# Altium schematic sheet 0091_USB3.SchDoc
size 848 x 558 mm
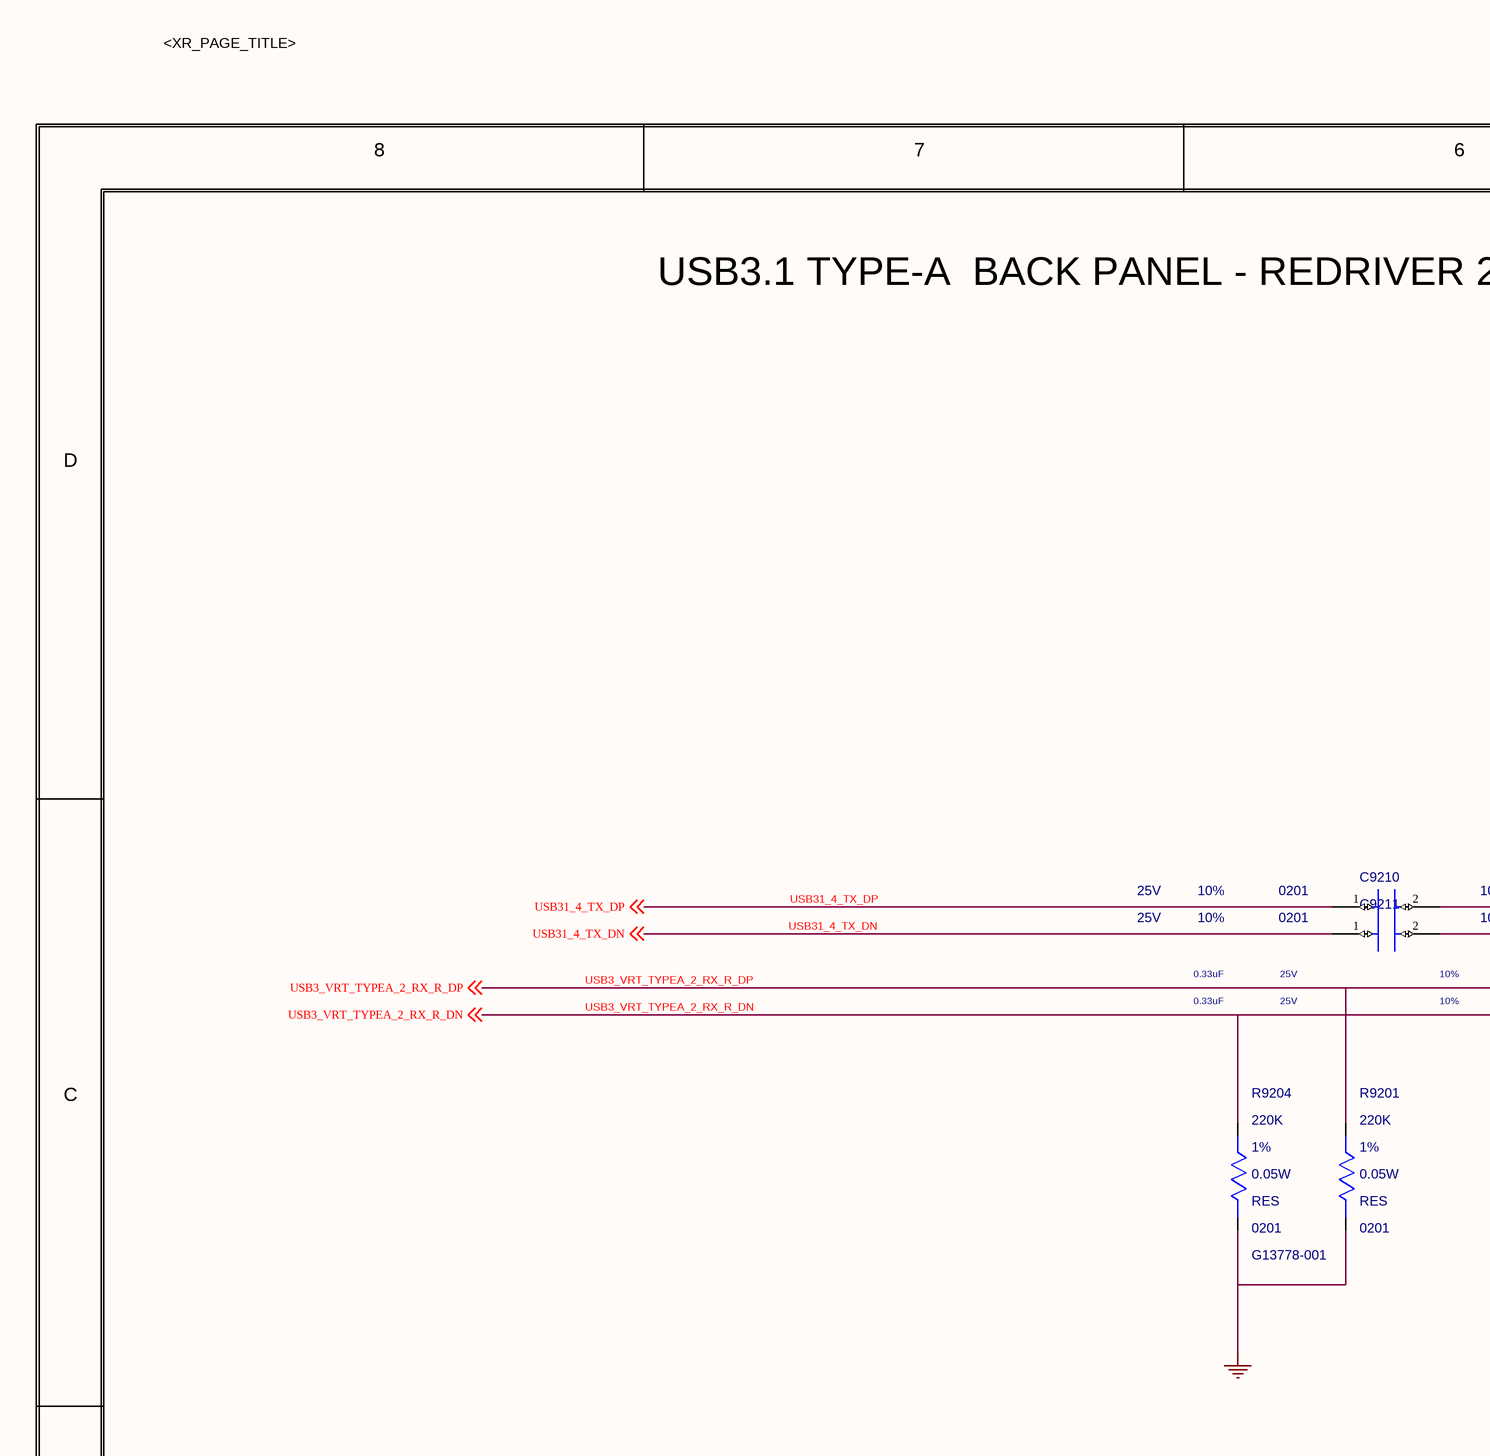
[diagram p0: 0091_USB3.SchDoc, top left]
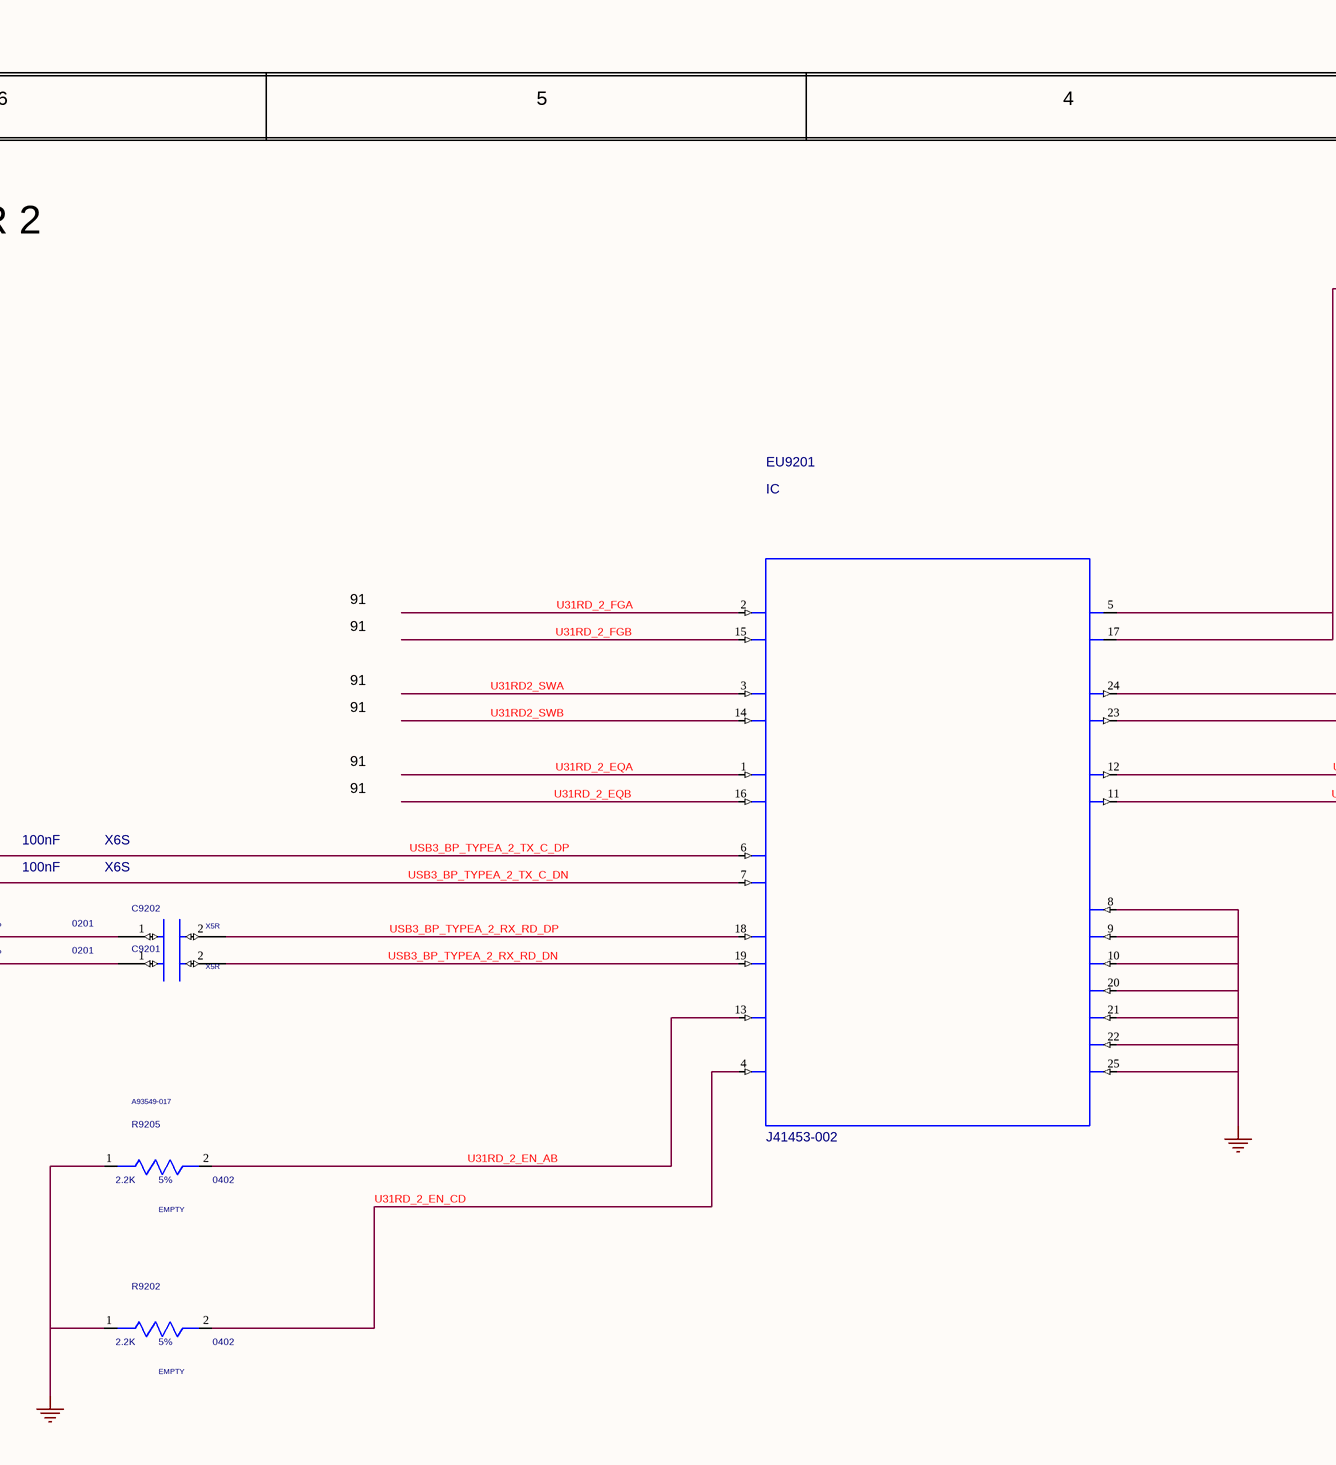
[diagram p1: 0091_USB3.SchDoc, top middle]
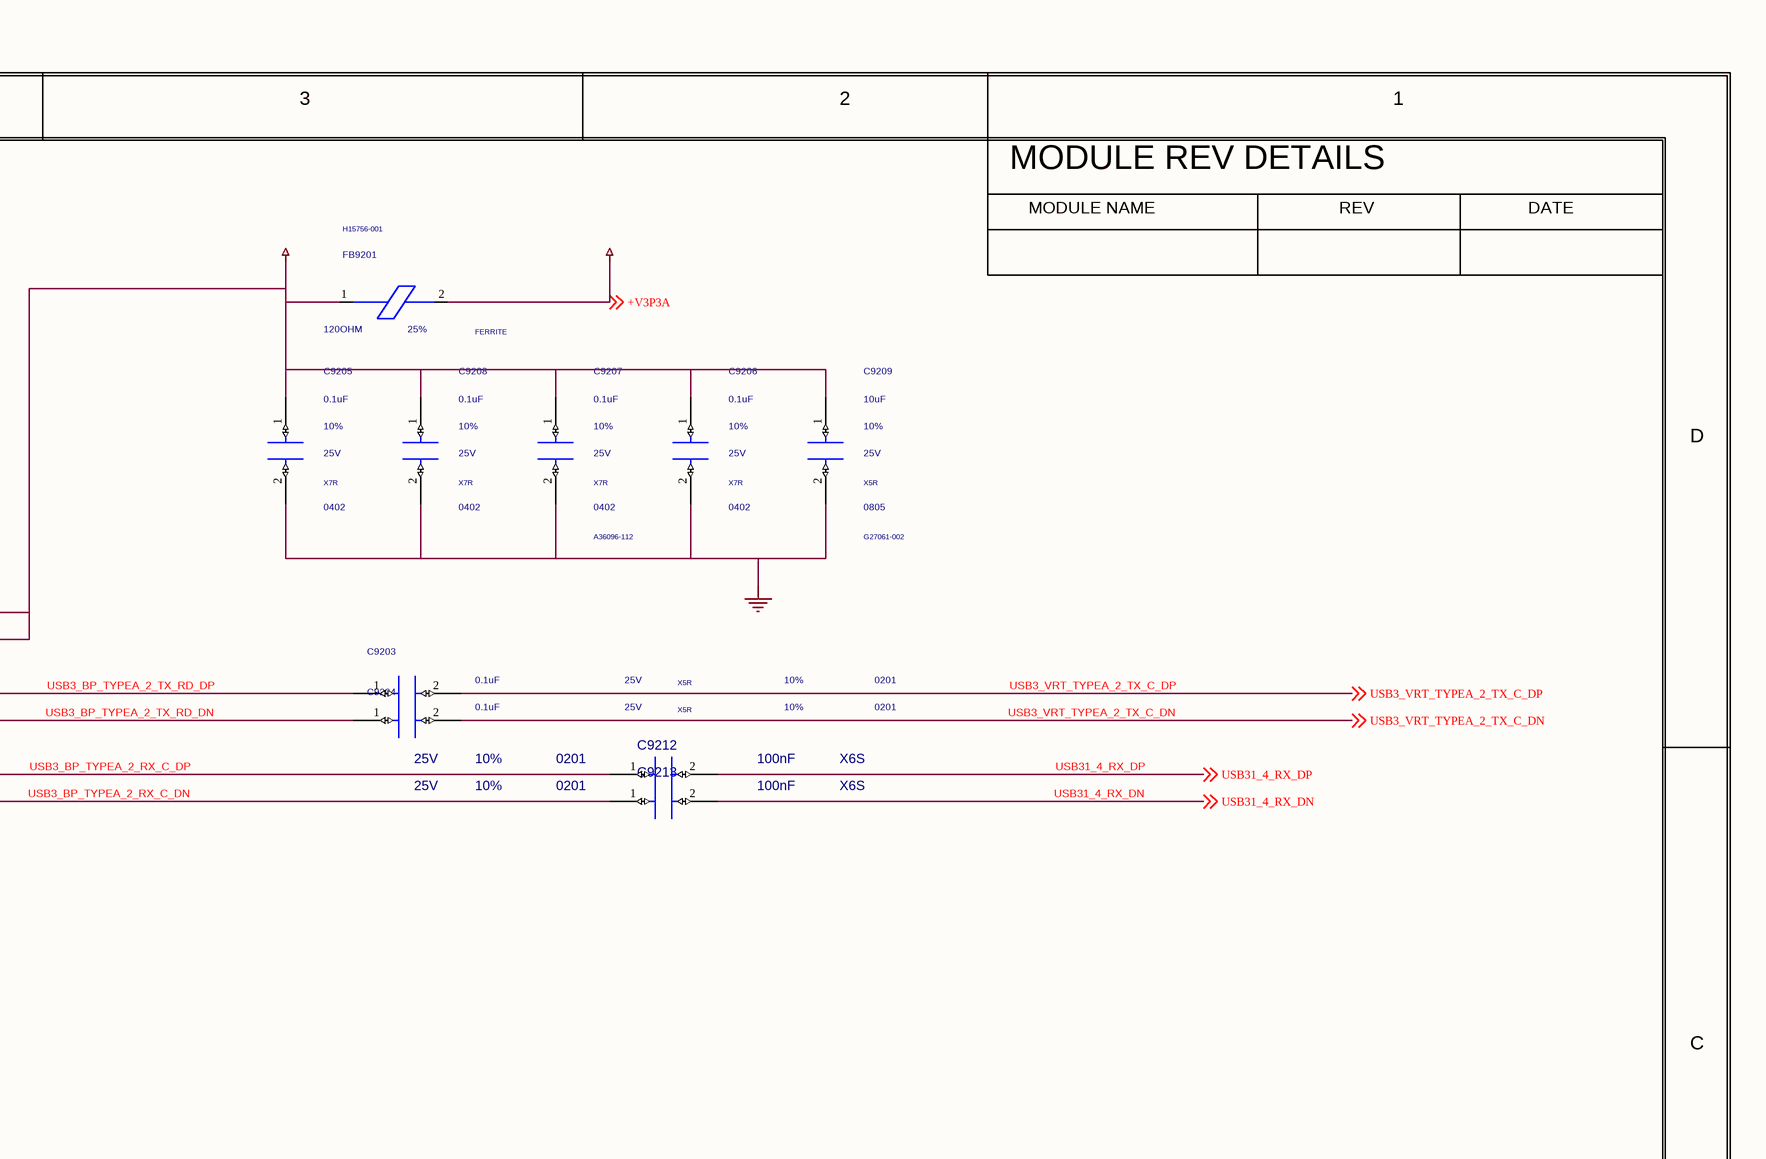
[diagram p2: 0091_USB3.SchDoc, top right]
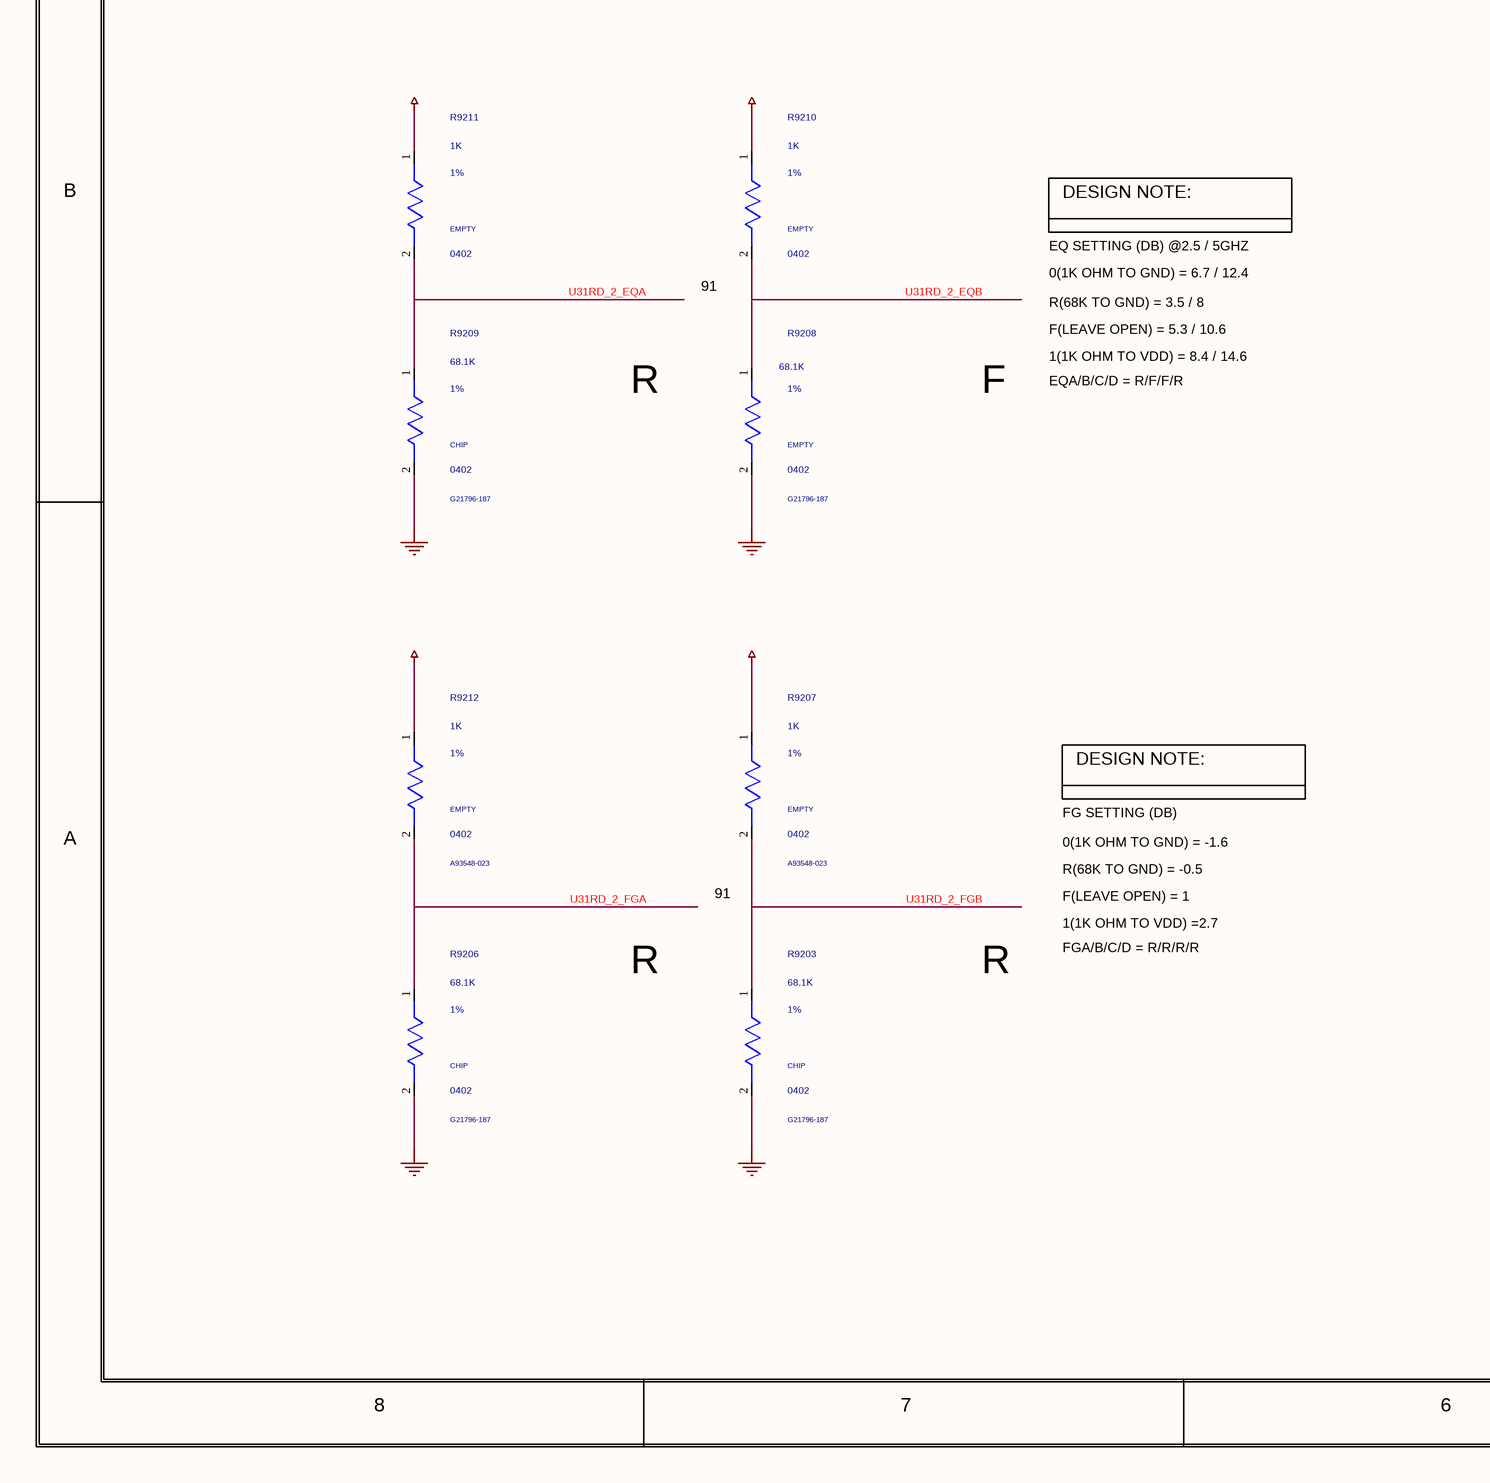
[diagram p3: 0091_USB3.SchDoc, bottom left]
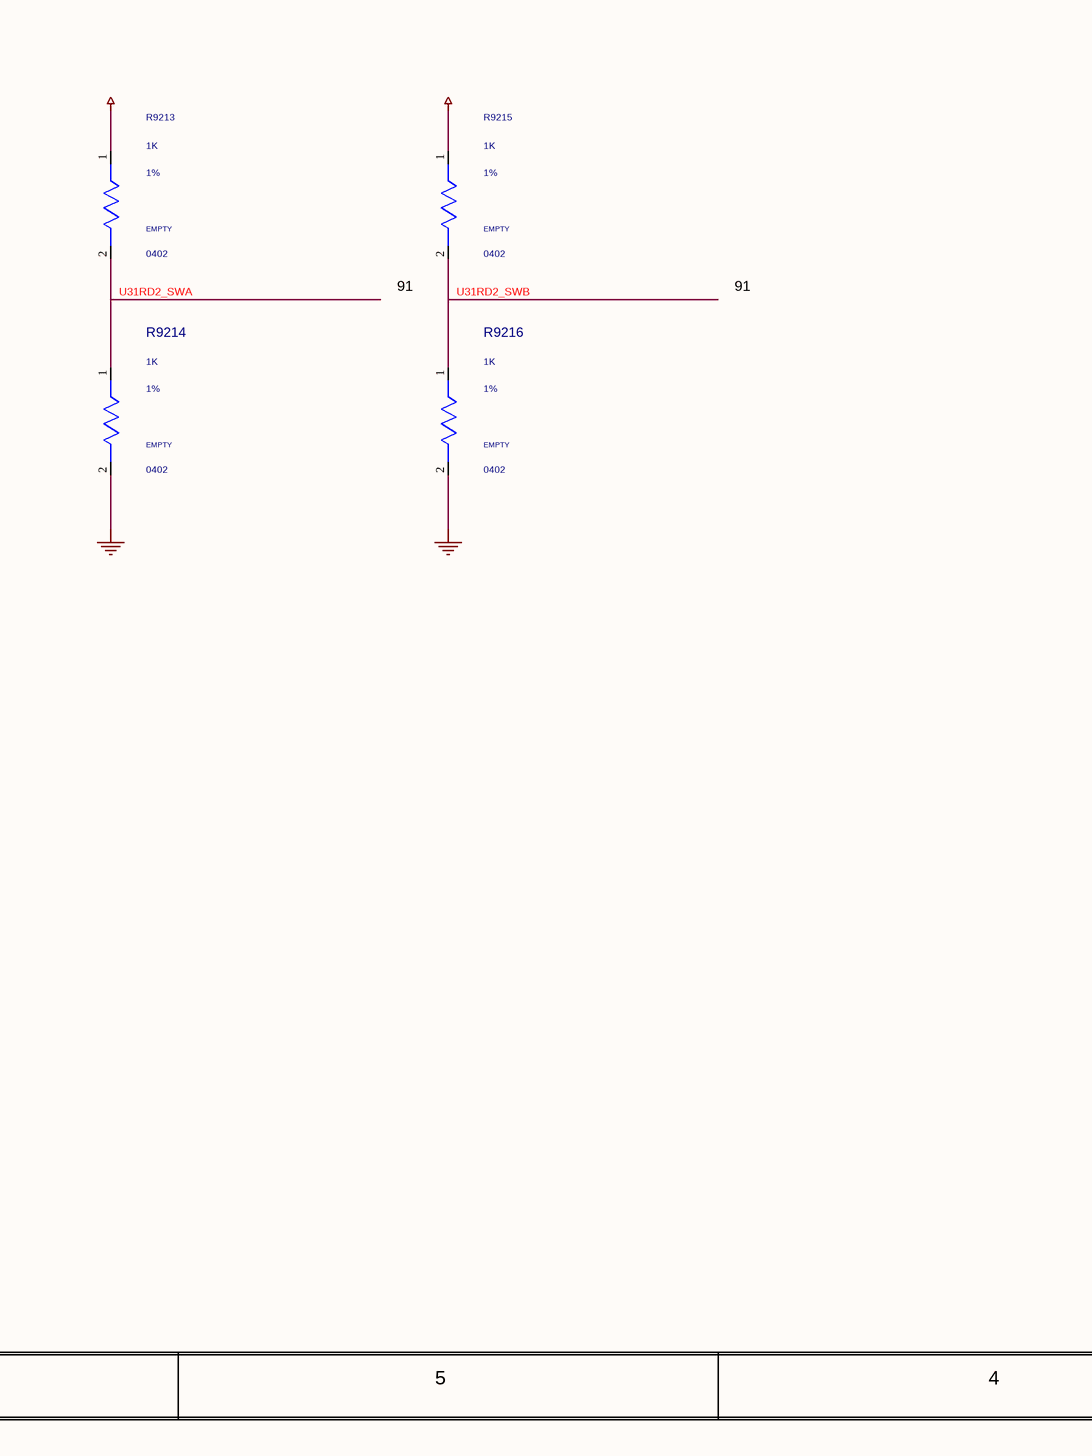
[diagram p4: 0091_USB3.SchDoc, bottom middle]
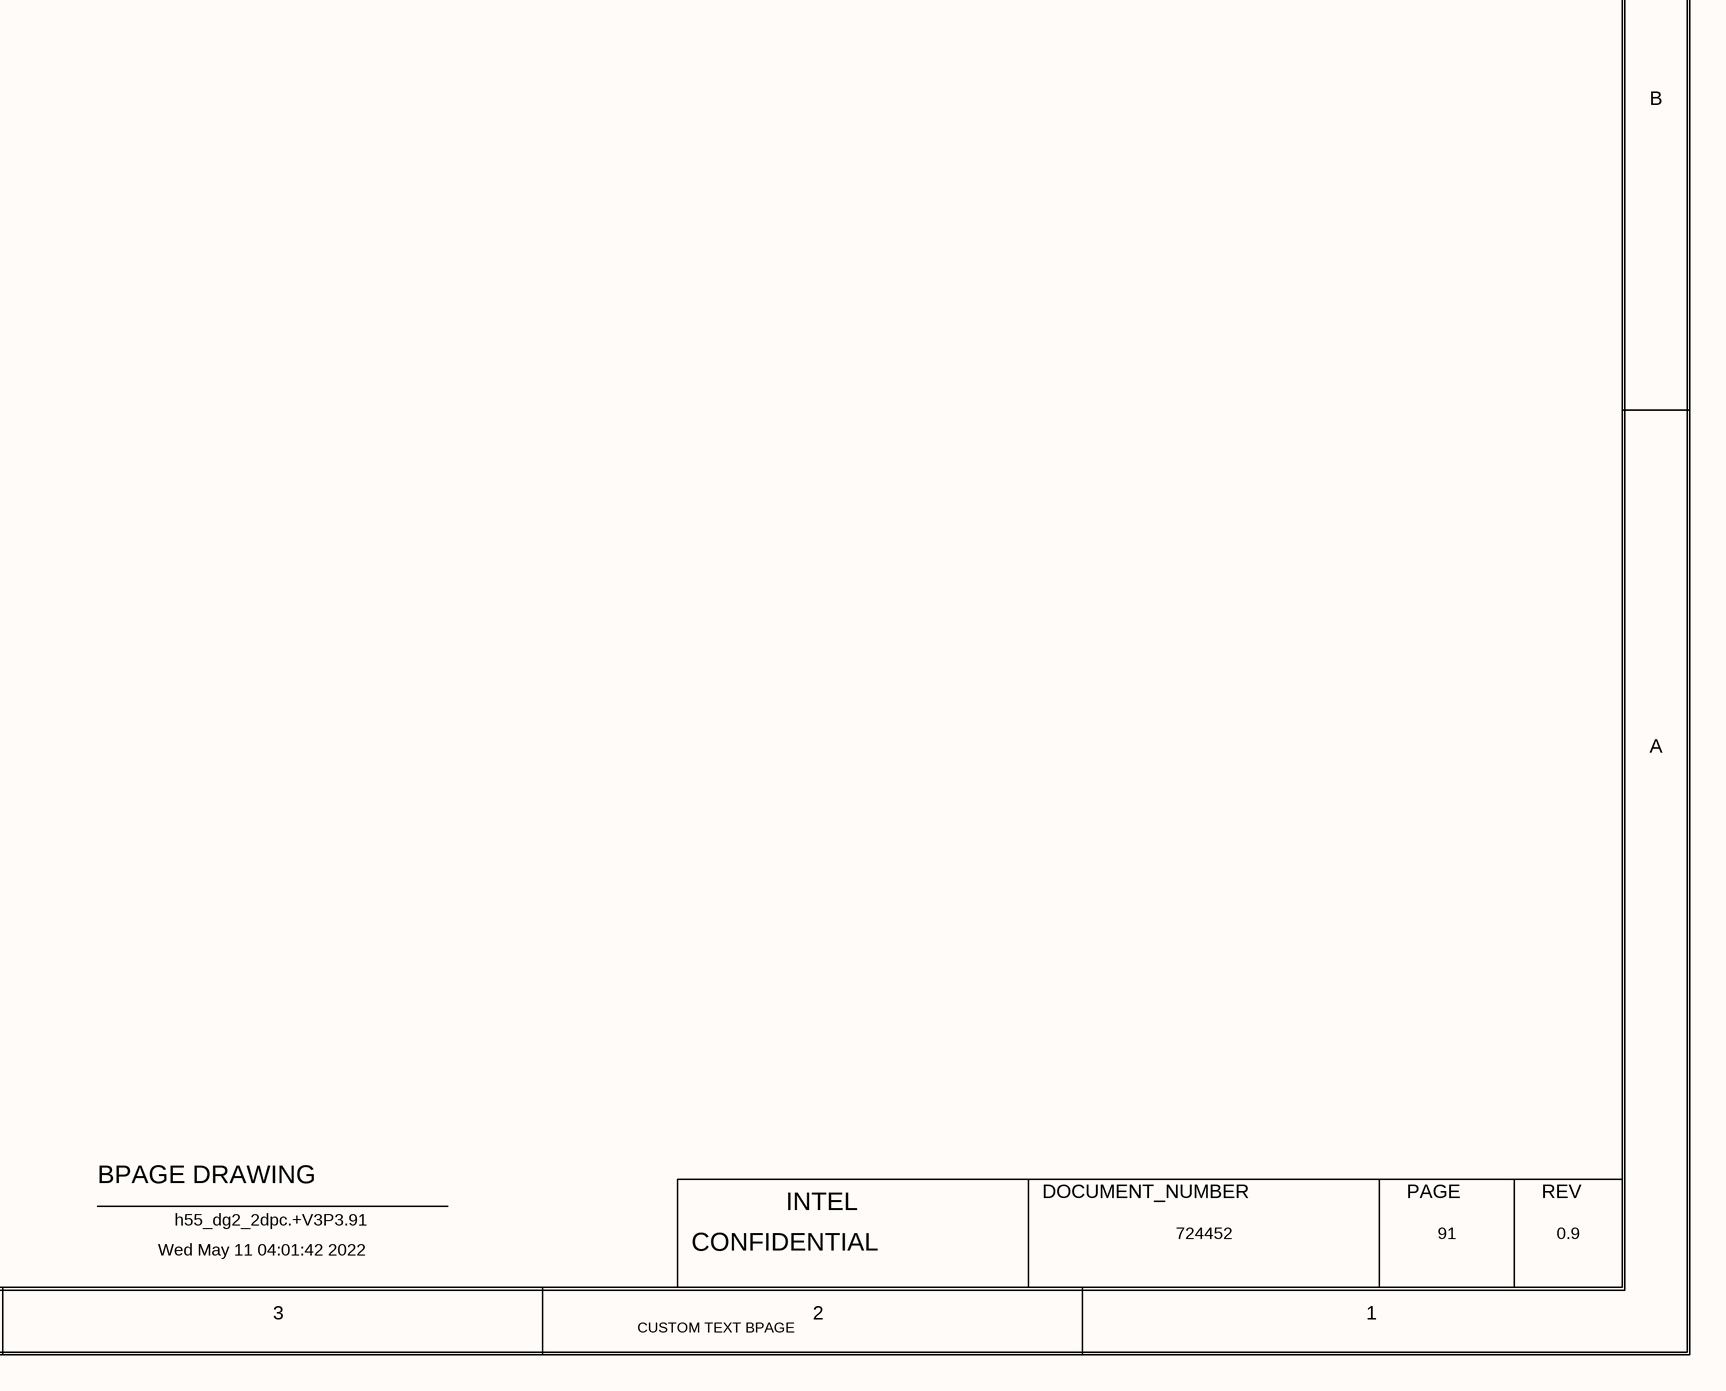
[diagram p5: 0091_USB3.SchDoc, bottom right]

## Parts
C9201  0.33uF  MATERIAL: X5R  PACK_TYPE: 0201  TOLERANCE: 10%  VOLTAGE: 25V  [SMC0201IA]
C9202  0.33uF  MATERIAL: X5R  PACK_TYPE: 0201  TOLERANCE: 10%  VOLTAGE: 25V  [SMC0201IA]
C9203  0.1uF  MATERIAL: X5R  PACK_TYPE: 0201  TOLERANCE: 10%  VOLTAGE: 25V  [SMC0201IA]
C9204  0.1uF  MATERIAL: X5R  PACK_TYPE: 0201  TOLERANCE: 10%  VOLTAGE: 25V  [SMC0201IA]
C9205  0.1uF  MATERIAL: X7R  PACK_TYPE: 0402  TOLERANCE: 10%  VOLTAGE: 25V  [SMC0402IA]
C9206  0.1uF  MATERIAL: X7R  PACK_TYPE: 0402  TOLERANCE: 10%  VOLTAGE: 25V  [SMC0402IA]
C9207  0.1uF  MATERIAL: X7R  PACK_TYPE: 0402  PART_NUMBER: A36096-112  TOLERANCE: 10%  VOLTAGE: 25V  [SMC0402IA]
C9208  0.1uF  MATERIAL: X7R  PACK_TYPE: 0402  TOLERANCE: 10%  VOLTAGE: 25V  [SMC0402IA]
C9209  10uF  MATERIAL: X5R  PACK_TYPE: 0805  PART_NUMBER: G27061-002  TOLERANCE: 10%  VOLTAGE: 25V  [SMC0805MA]
C9210  100nF  MATERIAL: X6S  PACK_TYPE: 0201  TOLERANCE: 10%  VOLTAGE: 25V  [SMC0201IA]
C9211  100nF  MATERIAL: X6S  PACK_TYPE: 0201  TOLERANCE: 10%  VOLTAGE: 25V  [SMC0201IA]
C9212  100nF  MATERIAL: X6S  PACK_TYPE: 0201  TOLERANCE: 10%  VOLTAGE: 25V  [SMC0201IA]
C9213  100nF  MATERIAL: X6S  PACK_TYPE: 0201  TOLERANCE: 10%  VOLTAGE: 25V  [SMC0201IA]
EU9201  MATERIAL: IC  PART_NUMBER: J41453-002  [CTK2_LCC24_S2550_350_DFS1400_MA]  (hidden comment: C_PI3EQX1002E)
FB9201  120OHM  PART_NUMBER: H15756-001  TOLERANCE: 25%  [SFB0603IB]
R9201  220K  MATERIAL: RES  PACK_TYPE: 0201  TOLERANCE: 1%  WATTAGE: 0.05W  [CTK2_SM0201_650X350_MA]
R9202  2.2K  MATERIAL: EMPTY  PACK_TYPE: 0402  TOLERANCE: 5%  [SMR0402IA]
R9203  68.1K  MATERIAL: CHIP  PACK_TYPE: 0402  PART_NUMBER: G21796-187  TOLERANCE: 1%  [SMR0402IA]
R9204  220K  MATERIAL: RES  PACK_TYPE: 0201  PART_NUMBER: G13778-001  TOLERANCE: 1%  WATTAGE: 0.05W  [CTK2_SM0201_650X350_MA]
R9205  2.2K  MATERIAL: EMPTY  PACK_TYPE: 0402  PART_NUMBER: A93549-017  TOLERANCE: 5%  [SMR0402IA]
R9206  68.1K  MATERIAL: CHIP  PACK_TYPE: 0402  PART_NUMBER: G21796-187  TOLERANCE: 1%  [SMR0402IA]
R9207  1K  MATERIAL: EMPTY  PACK_TYPE: 0402  PART_NUMBER: A93548-023  TOLERANCE: 1%  [SMR0402IA]
R9208  68.1K  MATERIAL: EMPTY  PACK_TYPE: 0402  PART_NUMBER: G21796-187  TOLERANCE: 1%  [SMR0402IA]
R9209  68.1K  MATERIAL: CHIP  PACK_TYPE: 0402  PART_NUMBER: G21796-187  TOLERANCE: 1%  [SMR0402IA]
R9210  1K  MATERIAL: EMPTY  PACK_TYPE: 0402  TOLERANCE: 1%  [SMR0402IA]
R9211  1K  MATERIAL: EMPTY  PACK_TYPE: 0402  TOLERANCE: 1%  [SMR0402IA]
R9212  1K  MATERIAL: EMPTY  PACK_TYPE: 0402  PART_NUMBER: A93548-023  TOLERANCE: 1%  [SMR0402IA]
R9213  1K  MATERIAL: EMPTY  PACK_TYPE: 0402  TOLERANCE: 1%  [SMR0402IA]
R9214  1K  MATERIAL: EMPTY  PACK_TYPE: 0402  TOLERANCE: 1%  [SMR0402IA]
R9215  1K  MATERIAL: EMPTY  PACK_TYPE: 0402  TOLERANCE: 1%  [SMR0402IA]
R9216  1K  MATERIAL: EMPTY  PACK_TYPE: 0402  TOLERANCE: 1%  [SMR0402IA]

## Nets
+V3P3_DUAL_USBRD_2: C9205.1(A) C9206.1(A) C9207.1(A) C9208.1(A) C9209.1(A) EU9201.5(VDD_1) EU9201.17(VDD_2) FB9201.1(A) R9207.1(A) R9210.1(A) R9211.1(A) R9212.1(A) R9213.1(A) R9215.1(A)
+V3P3A: FB9201.2(B) ; off-sheet +V3P3A
GND: C9205.2(B) C9206.2(B) C9207.2(B) C9208.2(B) C9209.2(B) EU9201.8(GND_1) EU9201.9(GND_2) EU9201.10(GND_3) EU9201.20(GND_4) EU9201.21(GND_5) EU9201.22(GND_6) EU9201.25(GND_TPD) R9201.2(B) R9202.1(A) R9203.2(B) R9204.2(B) R9205.1(A) R9206.2(B) R9208.2(B) R9209.2(B) R9214.2(B) R9216.2(B)
U31RD2_SWA: EU9201.3(SWA) R9213.2(B) R9214.1(A)
U31RD2_SWB: EU9201.14(SWB) R9215.2(B) R9216.1(A)
U31RD_2_EN_AB: EU9201.13(RXDET_EN) R9205.2(B)
U31RD_2_EN_CD: EU9201.4(EN) R9202.2(B)
U31RD_2_EQA: EU9201.1(EQA) R9209.1(A) R9211.2(B)
U31RD_2_EQB: EU9201.16(EQB) R9208.1(A) R9210.2(B)
U31RD_2_FGA: EU9201.2(FGA) R9206.1(A) R9212.2(B)
U31RD_2_FGB: EU9201.15(FGB) R9203.1(A) R9207.2(B)
USB3_BP_TYPEA_2_RX_C_DN: C9213.1(A) EU9201.11(BON)
USB3_BP_TYPEA_2_RX_C_DP: C9212.1(A) EU9201.12(BOP)
USB3_BP_TYPEA_2_RX_RD_DN: C9201.2(B) EU9201.19(BIN)
USB3_BP_TYPEA_2_RX_RD_DP: C9202.2(B) EU9201.18(BIP)
USB3_BP_TYPEA_2_TX_C_DN: C9211.2(B) EU9201.7(AIN)
USB3_BP_TYPEA_2_TX_C_DP: C9210.2(B) EU9201.6(AIP)
USB3_BP_TYPEA_2_TX_RD_DN: C9204.1(A) EU9201.23(AON)
USB3_BP_TYPEA_2_TX_RD_DP: C9203.1(A) EU9201.24(AOP)
USB3_VRT_TYPEA_2_RX_R_DN: C9201.1(A) R9204.1(A) ; off-sheet USB3_VRT_TYPEA_2_RX_R_DN
USB3_VRT_TYPEA_2_RX_R_DP: C9202.1(A) R9201.1(A) ; off-sheet USB3_VRT_TYPEA_2_RX_R_DP
USB3_VRT_TYPEA_2_TX_C_DN: C9204.2(B) ; off-sheet USB3_VRT_TYPEA_2_TX_C_DN
USB3_VRT_TYPEA_2_TX_C_DP: C9203.2(B) ; off-sheet USB3_VRT_TYPEA_2_TX_C_DP
USB31_4_RX_DN: C9213.2(B) ; off-sheet USB31_4_RX_DN
USB31_4_RX_DP: C9212.2(B) ; off-sheet USB31_4_RX_DP
USB31_4_TX_DN: C9211.1(A) ; off-sheet USB31_4_TX_DN
USB31_4_TX_DP: C9210.1(A) ; off-sheet USB31_4_TX_DP

## Notes on the sheet
- <XR_PAGE_TITLE>
- 8
- 7
- 6
- 5
- 4
- 3
- 2
- 1
- MODULE REV DETAILS
- USB3.1 TYPE-A  BACK PANEL - REDRIVER 2
- MODULE NAME
- REV
- DATE
- D
- 91
- C
- B
- DESIGN NOTE:
- (near R9210) 91
- 0(1K OHM TO GND) = 6.7 / 12.4
- EQ SETTING (DB) @2.5 / 5GHZ
- R(68K TO GND) = 3.5 / 8
- F(LEAVE OPEN) = 5.3 / 10.6
- 1(1K OHM TO VDD) = 8.4 / 14.6
- (near R9215) 91
- R
- F
- EQA/B/C/D = R/F/F/R
- FG SETTING (DB)
- A
- 0(1K OHM TO GND) = -1.6
- R(68K TO GND) = -0.5
- F(LEAVE OPEN) = 1
- 1(1K OHM TO VDD) =2.7
- FGA/B/C/D = R/R/R/R
- BPAGE DRAWING
- INTEL
- DOCUMENT_NUMBER
- PAGE
- Wed May 11 04:01:42 2022
- h55_dg2_2dpc.+V3P3.91
- CONFIDENTIAL
- 724452
- 0.9
- CUSTOM TEXT BPAGE

## Library data of the parts
C9201 = CAP#1: PART_NUMBER: J96611-001; CHIPS_PART_NAME: CAP; CDS_PHYS_PART_NAME: CAP_0201-J96611-001,X5R,0.33UF,25V,10%,LPDB,GENERIC; OriginalSymbolOrigin: (-25,50); XY: (-5600,3500); VER: 2; ROT: 0; PHYS_PAGE: 91; LOCATION: C9201; IP: GENERIC; FP_TECH: LPDB; DRAWING: @RVP1_ADL_SB_ADP_S_DDR5_SODIMM_2DPC_LIB.H55_DG2_2DPC(SCH_1):PAGE462; CDS_LIB: discrete; PCB Footprint: SMC0201IA; SEC_TYPE: 0201; CDS_PART_NAME: CAP_0201-J96611-001,X5R,0.33UF,25V,10%,LPDB,GENERIC; CDS_LOCATION: C9201; ASI_MODEL: J96611-001
C9202 = CAP#1: PART_NUMBER: J96611-001; CHIPS_PART_NAME: CAP; CDS_PHYS_PART_NAME: CAP_0201-J96611-001,X5R,0.33UF,25V,10%,LPDB,GENERIC; OriginalSymbolOrigin: (-25,50); XY: (-5600,3550); VER: 2; ROT: 0; PHYS_PAGE: 91; LOCATION: C9202; IP: GENERIC; FP_TECH: LPDB; DRAWING: @RVP1_ADL_SB_ADP_S_DDR5_SODIMM_2DPC_LIB.H55_DG2_2DPC(SCH_1):PAGE462; CDS_LIB: discrete; PCB Footprint: SMC0201IA; SEC_TYPE: 0201; CDS_PART_NAME: CAP_0201-J96611-001,X5R,0.33UF,25V,10%,LPDB,GENERIC; CDS_LOCATION: C9202; ASI_MODEL: J96611-001
C9203 = CAP#1: PART_NUMBER: C83410-027; CHIPS_PART_NAME: CAP; CDS_PHYS_PART_NAME: CAP_0201-C83410-027,X5R,0.1UF,25V,10%,LPDB,GENERIC; OriginalSymbolOrigin: (-25,50); XY: (-2750,4000); VER: 2; ROT: 0; PHYS_PAGE: 91; LOCATION: C9203; IP: GENERIC; FP_TECH: LPDB; DRAWING: @RVP1_ADL_SB_ADP_S_DDR5_SODIMM_2DPC_LIB.H55_DG2_2DPC(SCH_1):PAGE462; CDS_LIB: discrete; PCB Footprint: SMC0201IA; SEC_TYPE: 0201; CDS_PART_NAME: CAP_0201-C83410-027,X5R,0.1UF,25V,10%,LPDB,GENERIC; CDS_LOCATION: C9203; ASI_MODEL: C83410-027
C9204 = CAP#1: PART_NUMBER: C83410-027; CHIPS_PART_NAME: CAP; CDS_PHYS_PART_NAME: CAP_0201-C83410-027,X5R,0.1UF,25V,10%,LPDB,GENERIC; OriginalSymbolOrigin: (-25,50); XY: (-2750,3950); VER: 2; ROT: 0; PHYS_PAGE: 91; LOCATION: C9204; IP: GENERIC; FP_TECH: LPDB; DRAWING: @RVP1_ADL_SB_ADP_S_DDR5_SODIMM_2DPC_LIB.H55_DG2_2DPC(SCH_1):PAGE462; CDS_LIB: discrete; PCB Footprint: SMC0201IA; SEC_TYPE: 0201; CDS_PART_NAME: CAP_0201-C83410-027,X5R,0.1UF,25V,10%,LPDB,GENERIC; CDS_LOCATION: C9204; ASI_MODEL: C83410-027
C9205 = CAP: PART_NUMBER: A36096-112; CDS_PHYS_PART_NAME: CAP_0402-A36096-112,X7R,0.1UF,25V,10%,LPDB,GENERIC; OriginalSymbolOrigin: (-50,25); XY: (-2975,4450); VER: 1; ROT: 0; PHYS_PAGE: 91; LOCATION: C9205; IP: GENERIC; FP_TECH: LPDB; DRAWING: @RVP1_ADL_SB_ADP_S_DDR5_SODIMM_2DPC_LIB.H55_DG2_2DPC(SCH_1):PAGE462; CDS_LIB: discrete; PCB Footprint: SMC0402IA; CHIPS_PART_NAME: CAP; CDS_PART_NAME: CAP_0402-A36096-112,X7R,0.1UF,25V,10%,LPDB,GENERIC; CDS_LOCATION: C9205; ASI_MODEL: A36096-112
C9206 = CAP: PART_NUMBER: A36096-112; CDS_PHYS_PART_NAME: CAP_0402-A36096-112,X7R,0.1UF,25V,10%,LPDB,GENERIC; OriginalSymbolOrigin: (-50,25); XY: (-2225,4450); VER: 1; ROT: 0; PHYS_PAGE: 91; LOCATION: C9206; IP: GENERIC; FP_TECH: LPDB; DRAWING: @RVP1_ADL_SB_ADP_S_DDR5_SODIMM_2DPC_LIB.H55_DG2_2DPC(SCH_1):PAGE462; CDS_LIB: discrete; PCB Footprint: SMC0402IA; CHIPS_PART_NAME: CAP; CDS_PART_NAME: CAP_0402-A36096-112,X7R,0.1UF,25V,10%,LPDB,GENERIC; CDS_LOCATION: C9206; ASI_MODEL: A36096-112
C9207 = CAP: CDS_PHYS_PART_NAME: CAP_0402-A36096-112,X7R,0.1UF,25V,10%,LPDB,GENERIC; OriginalSymbolOrigin: (-50,25); XY: (-2475,4450); VER: 1; ROT: 0; PHYS_PAGE: 91; LOCATION: C9207; IP: GENERIC; FP_TECH: LPDB; DRAWING: @RVP1_ADL_SB_ADP_S_DDR5_SODIMM_2DPC_LIB.H55_DG2_2DPC(SCH_1):PAGE462; CDS_LIB: discrete; PCB Footprint: SMC0402IA; CHIPS_PART_NAME: CAP; CDS_PART_NAME: CAP_0402-A36096-112,X7R,0.1UF,25V,10%,LPDB,GENERIC; CDS_LOCATION: C9207; ASI_MODEL: A36096-112
C9208 = CAP: PART_NUMBER: A36096-112; CDS_PHYS_PART_NAME: CAP_0402-A36096-112,X7R,0.1UF,25V,10%,LPDB,GENERIC; OriginalSymbolOrigin: (-50,25); XY: (-2725,4450); VER: 1; ROT: 0; PHYS_PAGE: 91; LOCATION: C9208; IP: GENERIC; FP_TECH: LPDB; DRAWING: @RVP1_ADL_SB_ADP_S_DDR5_SODIMM_2DPC_LIB.H55_DG2_2DPC(SCH_1):PAGE462; CDS_LIB: discrete; PCB Footprint: SMC0402IA; CHIPS_PART_NAME: CAP; CDS_PART_NAME: CAP_0402-A36096-112,X7R,0.1UF,25V,10%,LPDB,GENERIC; CDS_LOCATION: C9208; ASI_MODEL: A36096-112
C9209 = CAP: CDS_PHYS_PART_NAME: CAP_0805-G27061-002,X5R,10UF,25V,10%,LPDB,GENERIC; OriginalSymbolOrigin: (-50,25); XY: (-1975,4450); VER: 1; ROT: 0; PHYS_PAGE: 91; LOCATION: C9209; IP: GENERIC; FP_TECH: LPDB; DRAWING: @RVP1_ADL_SB_ADP_S_DDR5_SODIMM_2DPC_LIB.H55_DG2_2DPC(SCH_1):PAGE462; CDS_LIB: discrete; PCB Footprint: SMC0805MA; CHIPS_PART_NAME: CAP; CDS_PART_NAME: CAP_0805-G27061-002,X5R,10UF,25V,10%,LPDB,GENERIC; CDS_LOCATION: C9209; ASI_MODEL: G27061-002
C9210 = CAP#1: PART_NUMBER: H68299-001; CHIPS_PART_NAME: CAP; CDS_PHYS_PART_NAME: CAP_0201-H68299-001,X6S,100NF,25V,10%,LPDB,GENERIC; OriginalSymbolOrigin: (-25,50); XY: (-6050,3700); VER: 2; ROT: 0; PHYS_PAGE: 91; LOCATION: C9210; IP: GENERIC; FP_TECH: LPDB; DRAWING: @RVP1_ADL_SB_ADP_S_DDR5_SODIMM_2DPC_LIB.H55_DG2_2DPC(SCH_1):PAGE462; CDS_LIB: discrete; PCB Footprint: SMC0201IA; CDS_PART_NAME: CAP_0201-H68299-001,X6S,100NF,25V,10%,LPDB,GENERIC; CDS_LOCATION: C9210
C9211 = CAP#1: PART_NUMBER: H68299-001; CHIPS_PART_NAME: CAP; CDS_PHYS_PART_NAME: CAP_0201-H68299-001,X6S,100NF,25V,10%,LPDB,GENERIC; OriginalSymbolOrigin: (-25,50); XY: (-6050,3650); VER: 2; ROT: 0; PHYS_PAGE: 91; LOCATION: C9211; IP: GENERIC; FP_TECH: LPDB; DRAWING: @RVP1_ADL_SB_ADP_S_DDR5_SODIMM_2DPC_LIB.H55_DG2_2DPC(SCH_1):PAGE462; CDS_LIB: discrete; PCB Footprint: SMC0201IA; CDS_PART_NAME: CAP_0201-H68299-001,X6S,100NF,25V,10%,LPDB,GENERIC; CDS_LOCATION: C9211
C9212 = CAP#1: PART_NUMBER: H68299-001; CHIPS_PART_NAME: CAP; CDS_PHYS_PART_NAME: CAP_0201-H68299-001,X6S,100NF,25V,10%,LPDB,GENERIC; OriginalSymbolOrigin: (-25,50); XY: (-2275,3850); VER: 2; ROT: 0; PHYS_PAGE: 91; LOCATION: C9212; IP: GENERIC; FP_TECH: LPDB; DRAWING: @RVP1_ADL_SB_ADP_S_DDR5_SODIMM_2DPC_LIB.H55_DG2_2DPC(SCH_1):PAGE462; CDS_LIB: discrete; PCB Footprint: SMC0201IA; CDS_PART_NAME: CAP_0201-H68299-001,X6S,100NF,25V,10%,LPDB,GENERIC; CDS_LOCATION: C9212
C9213 = CAP#1: PART_NUMBER: H68299-001; CHIPS_PART_NAME: CAP; CDS_PHYS_PART_NAME: CAP_0201-H68299-001,X6S,100NF,25V,10%,LPDB,GENERIC; OriginalSymbolOrigin: (-25,50); XY: (-2275,3800); VER: 2; ROT: 0; PHYS_PAGE: 91; LOCATION: C9213; IP: GENERIC; FP_TECH: LPDB; DRAWING: @RVP1_ADL_SB_ADP_S_DDR5_SODIMM_2DPC_LIB.H55_DG2_2DPC(SCH_1):PAGE462; CDS_LIB: discrete; PCB Footprint: SMC0201IA; CDS_PART_NAME: CAP_0201-H68299-001,X6S,100NF,25V,10%,LPDB,GENERIC; CDS_LOCATION: C9213
EU9201 = C_PI3EQX1002E: CDS_PHYS_PART_NAME: C_PI3EQX1002E_LCC-J41453-002,IC,PI3EQX1002E2ZREX,TK2,GENERIC; CDS_LMAN_SYM_OUTLINE: -300,550,300,-500; FP_TECH: TK2; IP: GENERIC; PACK_TYPE: LCC; ROOM: NONE; OriginalSymbolOrigin: (-325,550); XY: (-4200,3700); VER: 1; ROT: 0; PHYS_PAGE: 91; LOCATION: EU9201; DRAWING: @RVP1_ADL_SB_ADP_S_DDR5_SODIMM_2DPC_LIB.H55_DG2_2DPC(SCH_1):PAGE462; CDS_LIB: local; VARIANT: ?; PCB Footprint: CTK2_LCC24_S2550_350_DFS1400_MA; SEC_TYPE: LCC; CHIPS_PART_NAME: C_PI3EQX1002E; CDS_PART_NAME: C_PI3EQX1002E_LCC-J41453-002,IC,PI3EQX1002E2ZREX,TK2,GENERIC; CDS_LOCATION: EU9201
FB9201 = FERRITE: CDS_PHYS_PART_NAME: FERRITE_0603-H15756-001,FERRITE,120OHM,25%,3A,LPDB,GENERIC; CURRENT: 3A; PACK_TYPE: 0603; OriginalSymbolOrigin: (-75,50); XY: (-2775,4725); VER: 1; ROT: 0; PHYS_PAGE: 91; LOCATION: FB9201; IP: GENERIC; FP_TECH: LPDB; DRAWING: @RVP1_ADL_SB_ADP_S_DDR5_SODIMM_2DPC_LIB.H55_DG2_2DPC(SCH_1):PAGE462; CDS_LIB: discrete; MATERIAL: FERRITE; PCB Footprint: SFB0603IB; SEC_TYPE: 0603; CHIPS_PART_NAME: FERRITE; CDS_PART_NAME: FERRITE_0603-H15756-001,FERRITE,120OHM,25%,3A,LPDB,GENERIC; CDS_LOCATION: FB9201
R9201 = C_RES: PART_NUMBER: G13778-001; CDS_PHYS_PART_NAME: C_RES_0201-G13778-001,RES,220K,1%,0.05W,TK2,GENERIC; CDS_LMAN_SYM_OUTLINE: -50,50,50,-50; FP_TECH: TK2; IP: GENERIC; ROOM: NONE; OriginalSymbolOrigin: (-25,75); XY: (-6125,3200); VER: 2; ROT: 0; PHYS_PAGE: 91; LOCATION: R9201; DRAWING: @RVP1_ADL_SB_ADP_S_DDR5_SODIMM_2DPC_LIB.H55_DG2_2DPC(SCH_1):PAGE462; CDS_LIB: c_discrete; VARIANT: ?; PCB Footprint: CTK2_SM0201_650X350_MA; CHIPS_PART_NAME: C_RES; CDS_PART_NAME: C_RES_0201-G13778-001,RES,220K,1%,0.05W,TK2,GENERIC; CDS_LOCATION: R9201
R9202 = RES#1: PART_NUMBER: A93549-017; CHIPS_PART_NAME: RES; CDS_PHYS_PART_NAME: RES_0402-A93549-017,EMPTY,2.2K,5%,1/16W,LPDB,GENERIC; WATTAGE: 1/16W; OriginalSymbolOrigin: (-75,25); XY: (-5625,2825); VER: 1; ROT: 0; PHYS_PAGE: 91; LOCATION: R9202; IP: GENERIC; FP_TECH: LPDB; DRAWING: @RVP1_ADL_SB_ADP_S_DDR5_SODIMM_2DPC_LIB.H55_DG2_2DPC(SCH_1):PAGE462; CDS_LIB: discrete; PCB Footprint: SMR0402IA; SEC_TYPE: 0402; CDS_PART_NAME: RES_0402-A93549-017,EMPTY,2.2K,5%,1/16W,LPDB,GENERIC; CDS_LOCATION: R9202; ASI_MODEL: A93549-017
R9203 = RES: CDS_PHYS_PART_NAME: RES_0402-G21796-187,CHIP,68.1K,1%,1/16W,LPDB,GENERIC; WATTAGE: 1/16W; OriginalSymbolOrigin: (-25,75); XY: (-7225,650); VER: 2; ROT: 0; PHYS_PAGE: 91; LOCATION: R9203; IP: GENERIC; FP_TECH: LPDB; DRAWING: @RVP1_ADL_SB_ADP_S_DDR5_SODIMM_2DPC_LIB.H55_DG2_2DPC(SCH_1):PAGE462; CDS_LIB: discrete; PCB Footprint: SMR0402IA; SEC_TYPE: 0402; CHIPS_PART_NAME: RES; CDS_PART_NAME: RES_0402-G21796-187,CHIP,68.1K,1%,1/16W,LPDB,GENERIC; CDS_LOCATION: R9203; ASI_MODEL: G21796-187
R9204 = C_RES: CDS_PHYS_PART_NAME: C_RES_0201-G13778-001,RES,220K,1%,0.05W,TK2,GENERIC; CDS_LMAN_SYM_OUTLINE: -50,50,50,-50; FP_TECH: TK2; IP: GENERIC; ROOM: NONE; OriginalSymbolOrigin: (-25,75); XY: (-6325,3200); VER: 2; ROT: 0; PHYS_PAGE: 91; LOCATION: R9204; DRAWING: @RVP1_ADL_SB_ADP_S_DDR5_SODIMM_2DPC_LIB.H55_DG2_2DPC(SCH_1):PAGE462; CDS_LIB: c_discrete; VARIANT: ?; PCB Footprint: CTK2_SM0201_650X350_MA; CHIPS_PART_NAME: C_RES; CDS_PART_NAME: C_RES_0201-G13778-001,RES,220K,1%,0.05W,TK2,GENERIC; CDS_LOCATION: R9204
R9205 = RES#1: CHIPS_PART_NAME: RES; CDS_PHYS_PART_NAME: RES_0402-A93549-017,EMPTY,2.2K,5%,1/16W,LPDB,GENERIC; WATTAGE: 1/16W; OriginalSymbolOrigin: (-75,25); XY: (-5625,3125); VER: 1; ROT: 0; PHYS_PAGE: 91; LOCATION: R9205; IP: GENERIC; FP_TECH: LPDB; DRAWING: @RVP1_ADL_SB_ADP_S_DDR5_SODIMM_2DPC_LIB.H55_DG2_2DPC(SCH_1):PAGE462; CDS_LIB: discrete; PCB Footprint: SMR0402IA; SEC_TYPE: 0402; CDS_PART_NAME: RES_0402-A93549-017,EMPTY,2.2K,5%,1/16W,LPDB,GENERIC; CDS_LOCATION: R9205; ASI_MODEL: A93549-017
R9206 = RES: CDS_PHYS_PART_NAME: RES_0402-G21796-187,CHIP,68.1K,1%,1/16W,LPDB,GENERIC; WATTAGE: 1/16W; OriginalSymbolOrigin: (-25,75); XY: (-7850,650); VER: 2; ROT: 0; PHYS_PAGE: 91; LOCATION: R9206; IP: GENERIC; FP_TECH: LPDB; DRAWING: @RVP1_ADL_SB_ADP_S_DDR5_SODIMM_2DPC_LIB.H55_DG2_2DPC(SCH_1):PAGE462; CDS_LIB: discrete; PCB Footprint: SMR0402IA; SEC_TYPE: 0402; CHIPS_PART_NAME: RES; CDS_PART_NAME: RES_0402-G21796-187,CHIP,68.1K,1%,1/16W,LPDB,GENERIC; CDS_LOCATION: R9206; ASI_MODEL: G21796-187
R9207 = RES: CDS_PHYS_PART_NAME: RES_0402-A93548-023,EMPTY,1K,1%,1/16W,LPDB,GENERIC; WATTAGE: 1/16W; OriginalSymbolOrigin: (-25,75); XY: (-7225,1125); VER: 2; ROT: 0; PHYS_PAGE: 91; LOCATION: R9207; IP: GENERIC; FP_TECH: LPDB; DRAWING: @RVP1_ADL_SB_ADP_S_DDR5_SODIMM_2DPC_LIB.H55_DG2_2DPC(SCH_1):PAGE462; CDS_LIB: discrete; PCB Footprint: SMR0402IA; CHIPS_PART_NAME: RES; CDS_PART_NAME: RES_0402-A93548-023,EMPTY,1K,1%,1/16W,LPDB,GENERIC; CDS_LOCATION: R9207; ASI_MODEL: A93548-023
R9208 = RES: CDS_PHYS_PART_NAME: RES_0402-G21796-187,EMPTY,68.1K,1%,1/16W,LPDB,GENERIC; WATTAGE: 1/16W; OriginalSymbolOrigin: (-25,75); XY: (-7225,1800); VER: 2; ROT: 0; PHYS_PAGE: 91; LOCATION: R9208; IP: GENERIC; FP_TECH: LPDB; DRAWING: @RVP1_ADL_SB_ADP_S_DDR5_SODIMM_2DPC_LIB.H55_DG2_2DPC(SCH_1):PAGE462; CDS_LIB: discrete; PCB Footprint: SMR0402IA; CHIPS_PART_NAME: RES; CDS_PART_NAME: RES_0402-G21796-187,EMPTY,68.1K,1%,1/16W,LPDB,GENERIC; CDS_LOCATION: R9208; ASI_MODEL: G21796-187
R9209 = RES: CDS_PHYS_PART_NAME: RES_0402-G21796-187,CHIP,68.1K,1%,1/16W,LPDB,GENERIC; WATTAGE: 1/16W; OriginalSymbolOrigin: (-25,75); XY: (-7850,1800); VER: 2; ROT: 0; PHYS_PAGE: 91; LOCATION: R9209; IP: GENERIC; FP_TECH: LPDB; DRAWING: @RVP1_ADL_SB_ADP_S_DDR5_SODIMM_2DPC_LIB.H55_DG2_2DPC(SCH_1):PAGE462; CDS_LIB: discrete; PCB Footprint: SMR0402IA; CHIPS_PART_NAME: RES; CDS_PART_NAME: RES_0402-G21796-187,CHIP,68.1K,1%,1/16W,LPDB,GENERIC; CDS_LOCATION: R9209; ASI_MODEL: G21796-187
R9210 = RES: PART_NUMBER: A93548-023; CDS_PHYS_PART_NAME: RES_0402-A93548-023,EMPTY,1K,1%,1/16W,LPDB,GENERIC; WATTAGE: 1/16W; OriginalSymbolOrigin: (-25,75); XY: (-7225,2200); VER: 2; ROT: 0; PHYS_PAGE: 91; LOCATION: R9210; IP: GENERIC; FP_TECH: LPDB; DRAWING: @RVP1_ADL_SB_ADP_S_DDR5_SODIMM_2DPC_LIB.H55_DG2_2DPC(SCH_1):PAGE462; CDS_LIB: discrete; PCB Footprint: SMR0402IA; CHIPS_PART_NAME: RES; CDS_PART_NAME: RES_0402-A93548-023,EMPTY,1K,1%,1/16W,LPDB,GENERIC; CDS_LOCATION: R9210; ASI_MODEL: A93548-023
R9211 = RES: PART_NUMBER: A93548-023; CDS_PHYS_PART_NAME: RES_0402-A93548-023,EMPTY,1K,1%,1/16W,LPDB,GENERIC; WATTAGE: 1/16W; OriginalSymbolOrigin: (-25,75); XY: (-7850,2200); VER: 2; ROT: 0; PHYS_PAGE: 91; LOCATION: R9211; IP: GENERIC; FP_TECH: LPDB; DRAWING: @RVP1_ADL_SB_ADP_S_DDR5_SODIMM_2DPC_LIB.H55_DG2_2DPC(SCH_1):PAGE462; CDS_LIB: discrete; PCB Footprint: SMR0402IA; CHIPS_PART_NAME: RES; CDS_PART_NAME: RES_0402-A93548-023,EMPTY,1K,1%,1/16W,LPDB,GENERIC; CDS_LOCATION: R9211; ASI_MODEL: A93548-023
R9212 = RES: CDS_PHYS_PART_NAME: RES_0402-A93548-023,EMPTY,1K,1%,1/16W,LPDB,GENERIC; WATTAGE: 1/16W; OriginalSymbolOrigin: (-25,75); XY: (-7850,1125); VER: 2; ROT: 0; PHYS_PAGE: 91; LOCATION: R9212; IP: GENERIC; FP_TECH: LPDB; DRAWING: @RVP1_ADL_SB_ADP_S_DDR5_SODIMM_2DPC_LIB.H55_DG2_2DPC(SCH_1):PAGE462; CDS_LIB: discrete; PCB Footprint: SMR0402IA; CHIPS_PART_NAME: RES; CDS_PART_NAME: RES_0402-A93548-023,EMPTY,1K,1%,1/16W,LPDB,GENERIC; CDS_LOCATION: R9212; ASI_MODEL: A93548-023
R9213 = RES: PART_NUMBER: A93548-023; CDS_PHYS_PART_NAME: RES_0402-A93548-023,EMPTY,1K,1%,1/16W,LPDB,GENERIC; WATTAGE: 1/16W; OriginalSymbolOrigin: (-25,75); XY: (-5550,2150); VER: 2; ROT: 0; PHYS_PAGE: 91; LOCATION: R9213; IP: GENERIC; FP_TECH: LPDB; DRAWING: @RVP1_ADL_SB_ADP_S_DDR5_SODIMM_2DPC_LIB.H55_DG2_2DPC(SCH_1):PAGE462; CDS_LIB: discrete; PCB Footprint: SMR0402IA; CHIPS_PART_NAME: RES; CDS_PART_NAME: RES_0402-A93548-023,EMPTY,1K,1%,1/16W,LPDB,GENERIC; CDS_LOCATION: R9213; ASI_MODEL: A93548-023
R9214 = RES: PART_NUMBER: A93548-023; CDS_PHYS_PART_NAME: RES_0402-A93548-023,EMPTY,1K,1%,1/16W,LPDB,GENERIC; WATTAGE: 1/16W; OriginalSymbolOrigin: (-25,75); XY: (-5550,1750); VER: 2; ROT: 0; PHYS_PAGE: 91; LOCATION: R9214; IP: GENERIC; FP_TECH: LPDB; DRAWING: @RVP1_ADL_SB_ADP_S_DDR5_SODIMM_2DPC_LIB.H55_DG2_2DPC(SCH_1):PAGE462; CDS_LIB: discrete; PCB Footprint: SMR0402IA; CHIPS_PART_NAME: RES; CDS_PART_NAME: RES_0402-A93548-023,EMPTY,1K,1%,1/16W,LPDB,GENERIC; CDS_LOCATION: R9214; ASI_MODEL: A93548-023
R9215 = RES: PART_NUMBER: A93548-023; CDS_PHYS_PART_NAME: RES_0402-A93548-023,EMPTY,1K,1%,1/16W,LPDB,GENERIC; WATTAGE: 1/16W; OriginalSymbolOrigin: (-25,75); XY: (-4925,2150); VER: 2; ROT: 0; PHYS_PAGE: 91; LOCATION: R9215; IP: GENERIC; FP_TECH: LPDB; DRAWING: @RVP1_ADL_SB_ADP_S_DDR5_SODIMM_2DPC_LIB.H55_DG2_2DPC(SCH_1):PAGE462; CDS_LIB: discrete; PCB Footprint: SMR0402IA; CHIPS_PART_NAME: RES; CDS_PART_NAME: RES_0402-A93548-023,EMPTY,1K,1%,1/16W,LPDB,GENERIC; CDS_LOCATION: R9215; ASI_MODEL: A93548-023
R9216 = RES: PART_NUMBER: A93548-023; CDS_PHYS_PART_NAME: RES_0402-A93548-023,EMPTY,1K,1%,1/16W,LPDB,GENERIC; WATTAGE: 1/16W; OriginalSymbolOrigin: (-25,75); XY: (-4925,1750); VER: 2; ROT: 0; PHYS_PAGE: 91; LOCATION: R9216; IP: GENERIC; FP_TECH: LPDB; DRAWING: @RVP1_ADL_SB_ADP_S_DDR5_SODIMM_2DPC_LIB.H55_DG2_2DPC(SCH_1):PAGE462; CDS_LIB: discrete; PCB Footprint: SMR0402IA; CHIPS_PART_NAME: RES; CDS_PART_NAME: RES_0402-A93548-023,EMPTY,1K,1%,1/16W,LPDB,GENERIC; CDS_LOCATION: R9216; ASI_MODEL: A93548-023